# Altium schematic sheet [3] CENR-40 PCA-10 NBU-1012 PWF SIMMER EMMITER.SchDoc
size A4
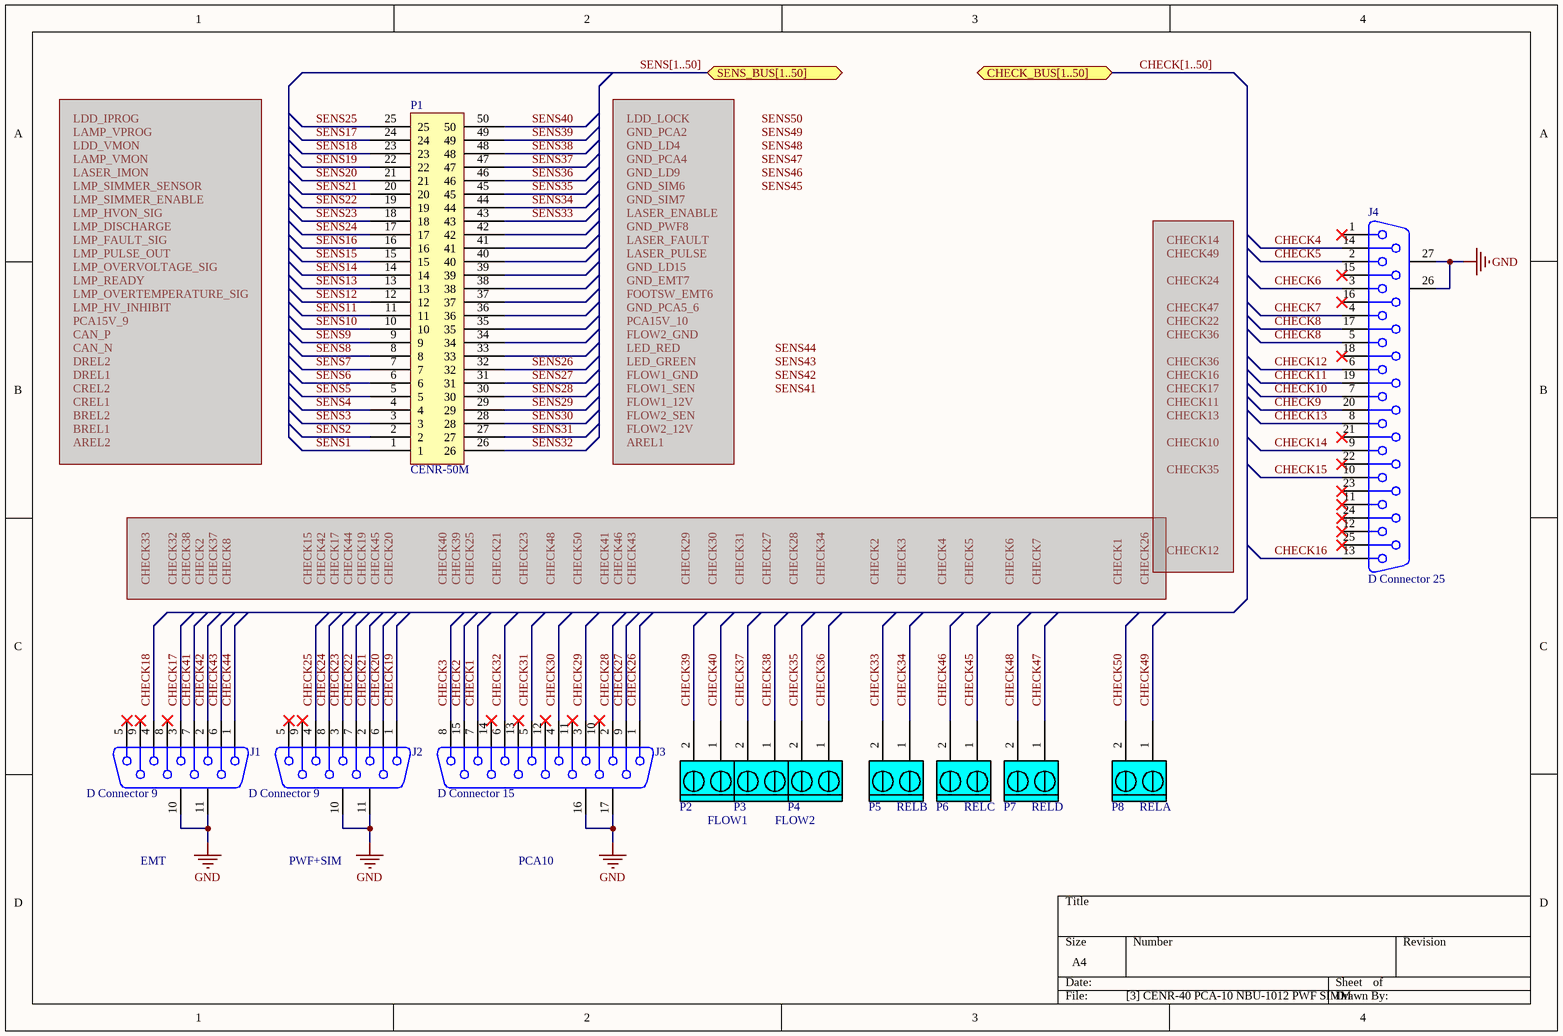
[diagram p0: [3] CENR-40 PCA-10 NBU-1012 PWF SIMMER EMMITER.SchDoc]

## Parts
J1  D Connector 9  [DSUB1.385-2H9F]
J2  D Connector 9  [DSUB1.385-2H9M]
J3  D Connector 15  [DSUB1.385-2H15M]
J4  D Connector 25  [DSUB1.385-2H25A-F]
P1  CENR-50M  [CENR-50M]
P2  DG340-3.81  [DG340-3.81-02P-00A(H)]  (value not drawn)
P3  DG340-3.81  [DG340-3.81-02P-00A(H)]  (value not drawn)
P4  DG340-3.81  [DG340-3.81-02P-00A(H)]  (value not drawn)
P5  DG340-3.81  [DG340-3.81-02P-00A(H)]  (value not drawn)
P6  DG340-3.81  [DG340-3.81-02P-00A(H)]  (value not drawn)
P7  DG340-3.81  [DG340-3.81-02P-00A(H)]  (value not drawn)
P8  DG340-3.81  [DG340-3.81-02P-00A(H)]  (value not drawn)

## Ports
CHECK_BUS[1..50], SENS_BUS[1..50]

## Nets
GND: J1.10(MH1) J1.11(MH2) J2.10(MH1) J2.11(MH2) J3.16(MH1) J3.17(MH2) J4.26(MH1) J4.27(MH2)
CHECK1: J3.7
CHECK2: J3.15
CHECK3: J3.8
CHECK4: J4.14
CHECK5: J4.2
CHECK6: J4.3
CHECK7: J4.4
CHECK8: J4.5 J4.17
CHECK9: J4.20
CHECK10: J4.7
CHECK11: J4.19
CHECK12: J4.6
CHECK13: J4.8
CHECK14: J4.9
CHECK15: J4.10
CHECK16: J4.13
CHECK17: J1.3
CHECK18: J1.4
CHECK19: J2.1
CHECK20: J2.6
CHECK21: J2.2
CHECK22: J2.7
CHECK23: J2.3
CHECK24: J2.8
CHECK25: J2.4
CHECK26: J3.1
CHECK27: J3.9
CHECK28: J3.2
CHECK29: J3.3
CHECK30: J3.4
CHECK31: J3.5
CHECK32: J3.6
CHECK33: P5.2
CHECK34: P5.1
CHECK35: P4.2
CHECK36: P4.1
CHECK37: P3.2
CHECK38: P3.1
CHECK39: P2.2
CHECK40: P2.1
CHECK41: J1.7
CHECK42: J1.2
CHECK43: J1.6
CHECK44: J1.1
CHECK45: P6.1
CHECK46: P6.2
CHECK47: P7.1
CHECK48: P7.2
CHECK49: P8.1
CHECK50: P8.2
SENS1: P1.1
SENS2: P1.2
SENS3: P1.3
SENS4: P1.4
SENS5: P1.5
SENS6: P1.6
SENS7: P1.7
SENS8: P1.8
SENS9: P1.9
SENS10: P1.10
SENS11: P1.11
SENS12: P1.12
SENS13: P1.13
SENS14: P1.14
SENS15: P1.15
SENS16: P1.16
SENS17: P1.24
SENS18: P1.23
SENS19: P1.22
SENS20: P1.21
SENS21: P1.20
SENS22: P1.19
SENS23: P1.18
SENS24: P1.17
SENS25: P1.25
SENS26: P1.32
SENS27: P1.31
SENS28: P1.30
SENS29: P1.29
SENS30: P1.28
SENS31: P1.27
SENS32: P1.26
SENS33: P1.43
SENS34: P1.44
SENS35: P1.45
SENS36: P1.46
SENS37: P1.47
SENS38: P1.48
SENS39: P1.49
SENS40: P1.50

Not connected (* = marked no-connect by the designer): J1 5* 8* 9*; J2 5* 9*; J3 10* 11* 12* 13* 14*; J4 1* 11* 12* 15* 16* 18* 21* 22* 23* 24* 25*; P1 33 34 35 36 37 38 39 40 41 42

## Buses and harness runs
bus CHECK[1..50] = port CHECK_BUS[1..50]
bus SENS[1..50] = port SENS_BUS[1..50]

## Notes on the sheet
- FLOW1
- FLOW2
- RELB
- RELC
- (near P7) RELD
- (near P8) RELA
- EMT
- PWF+SIM
- PCA10
- Labels drawn without touching a wire or pin: SENS41, SENS42, SENS43, SENS44, SENS45, SENS46, SENS47, SENS48, SENS49, SENS50

## Library data of the parts
J1 J2 = D Connector 9: Receptacle Assembly, 9 Position, Right Angle; PackageDocument: O; Positions: 9; Published: 15-Jun-2001; LatestRevisionDate: 17-Jul-2002; LatestRevisionNote: Re-released for DXP Platform.; DatasheetDocument: 1-Sep-1999; PackageReference: 788750; Publisher: Altium Limited; Orientation: Right Angle; Gender: Receptacle
J3 = D Connector 15: Receptacle Assembly, 15 Position, Right Angle; PackageDocument: O; Positions: 15; Published: 15-Jun-2001; LatestRevisionDate: 17-Jul-2002; LatestRevisionNote: Re-released for DXP Platform.; DatasheetDocument: 1-Sep-99; PackageReference: 788757; Publisher: Altium Limited; Orientation: Right Angle; Gender: Receptacle
J4 = D Connector 25: Receptacle Assembly, 25 Position, Right Angle; PackageDocument: U; Positions: 25; Published: 15-Jun-2001; LatestRevisionDate: 17-Jul-2002; LatestRevisionNote: Re-released for DXP Platform.; DatasheetDocument: 19-Mar-1999; PackageReference: 787202; Publisher: Altium Limited; Orientation: Right Angle; Gender: Receptacle
P2-P8 = DG340-3.81-02P: Terminal block